# EAGLE design clock (EAGLE 7.1.0)
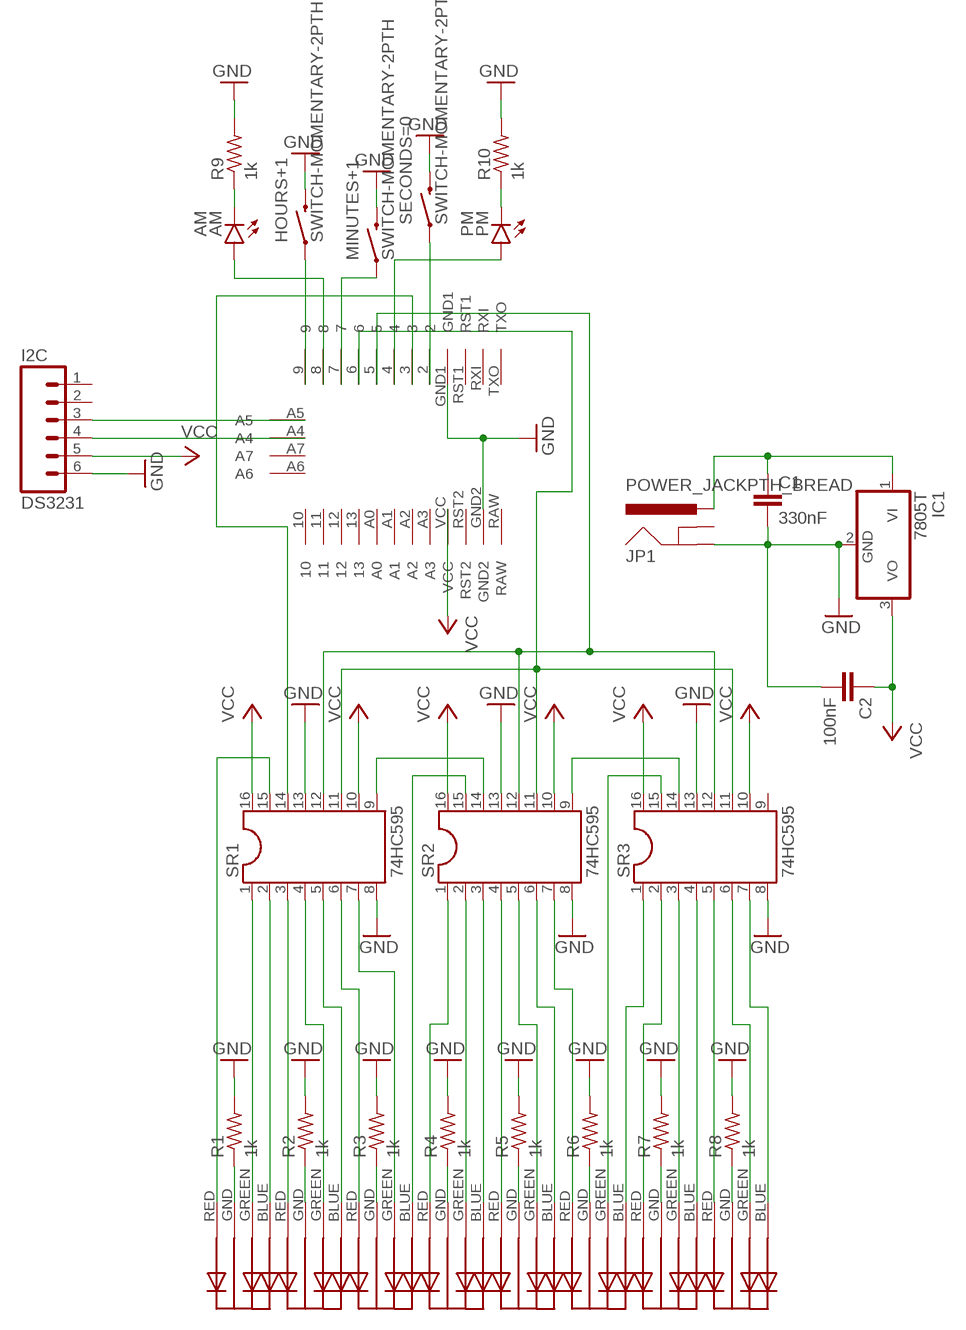
[diagram p0: schematic, sheet 1]

## Parts
AM  AM  LED5MM  [LED5MM]
C1  330nF  CAPPTH1  [CAP-PTH-5MM]
C2  100nF  CAPPTH1  [CAP-PTH-5MM]
DS3231  I2C  M06LOCK  [1X06_LOCK]
HOURS+1  SWITCH-MOMENTARY-2PTH  [TACTILE-PTH]
IC1  7805T  7805TV  [TO220V]
JP1  POWER_JACKPTH_BREAD  [POWER_JACK_PTH_BREAD]
MINUTES+1  SWITCH-MOMENTARY-2PTH  [TACTILE-PTH]
PM  PM  LED5MM  [LED5MM]
R1  1k  R-US_0207/10  [0207/10]
R2  1k  R-US_0207/10  [0207/10]
R3  1k  R-US_0207/10  [0207/10]
R4  1k  R-US_0207/10  [0207/10]
R5  1k  R-US_0207/10  [0207/10]
R6  1k  R-US_0207/10  [0207/10]
R7  1k  R-US_0207/10  [0207/10]
R8  1k  R-US_0207/10  [0207/10]
R9  1k  R-US_0207/10  [0207/10]
R10  1k  R-US_0207/10  [0207/10]
SECONDS=0  SWITCH-MOMENTARY-2PTH  [TACTILE-PTH]
SR1  74HC595  DIL16S  [SOCKET-16]
SR2  74HC595  DIL16S  [SOCKET-16]
SR3  74HC595  DIL16S  [SOCKET-16]
U$1  PRO-MINI  [PRO-MINI]
U$2  RGB_LED_COM_CATH  [RGB_LED_COM_CATH]
U$3  RGB_LED_COM_CATH  [RGB_LED_COM_CATH]
U$4  RGB_LED_COM_CATH  [RGB_LED_COM_CATH]
U$5  RGB_LED_COM_CATH  [RGB_LED_COM_CATH]
U$6  RGB_LED_COM_CATH  [RGB_LED_COM_CATH]
U$7  RGB_LED_COM_CATH  [RGB_LED_COM_CATH]
U$8  RGB_LED_COM_CATH  [RGB_LED_COM_CATH]
U$9  RGB_LED_COM_CATH  [RGB_LED_COM_CATH]

## Nets
GND: C1.2 C2.2 DS3231.6 HOURS+1.3 IC1.2(GND) JP1.GND MINUTES+1.3 R1.2 R2.2 R3.2 R4.2 R5.2 R6.2 R7.2 R8.2 R9.2 R10.2 SECONDS=0.3 SR1.8 SR1.13 SR2.8 SR2.13 SR3.8 SR3.13 U$1.GND1 U$1.GND2
N$1: SR1.6 U$2.RED
N$2: SR1.9 SR2.14
N$3: SR2.9 SR3.14
N$4: SR1.11 SR2.11 SR3.11 U$1.6
N$5: SR1.12 SR2.12 SR3.12 U$1.5
N$6: SR1.14 U$1.3
N$7: SR1.15 U$4.RED
N$8: SR1.1 U$4.GREEN
N$9: SR1.2 U$4.BLUE
N$10: R1.1 U$4.GND
N$11: SR1.3 U$3.RED
N$12: SR1.4 U$3.GREEN
N$13: SR1.5 U$3.BLUE
N$14: R2.1 U$3.GND
N$15: SR1.7 U$2.GREEN
N$16: SR2.15 U$2.BLUE
N$17: R3.1 U$2.GND
N$18: R4.1 U$5.GND
N$19: SR2.1 U$5.RED
N$20: SR2.2 U$5.GREEN
N$21: SR2.3 U$5.BLUE
N$22: SR2.4 U$6.RED
N$23: SR2.5 U$6.GREEN
N$24: SR2.6 U$6.BLUE
N$25: R5.1 U$6.GND
N$26: SR2.7 U$7.RED
N$27: R6.1 U$7.GND
N$28: SR3.3 U$8.GREEN
N$29: SR3.1 U$7.BLUE
N$30: SR3.15 U$7.GREEN
N$31: R7.1 U$8.GND
N$32: SR3.2 U$8.RED
N$33: SR3.4 U$8.BLUE
N$34: SR3.5 U$9.RED
N$35: R8.1 U$9.GND
N$36: SR3.6 U$9.GREEN
N$37: SR3.7 U$9.BLUE
N$38: DS3231.3 U$1.A5
N$39: DS3231.4 U$1.A4
N$40: HOURS+1.1 U$1.9
N$41: AM.A U$1.8
N$42: MINUTES+1.1 U$1.7
N$43: PM.A U$1.4
N$44: SECONDS=0.1 U$1.2
N$45: AM.K(C) R9.1
N$46: PM.K(C) R10.1
N$48: C1.1 IC1.1(VI) JP1.PWR
VCC: C2.1 DS3231.5 IC1.3(VO) SR1.10 SR1.16 SR2.10 SR2.16 SR3.10 SR3.16 U$1.VCC
Unconnected: DS3231.1 DS3231.2 JP1.GNDBREAK SR3.9 U$1.10 U$1.11 U$1.12 U$1.13 U$1.A0 U$1.A1 U$1.A2 U$1.A3 U$1.A6 U$1.A7 U$1.RAW U$1.RST1 U$1.RST2 U$1.RXI U$1.TXO

## Library data of the parts
AM PM = SparkFun-LED:LED: LEDs Standard schematic elements and footprints for 5mm, 3mm, 1206, and 0603 sized LEDs. 5mm - Spark Fun Electronics SKU : COM-00529 (and others)
C1 C2 = SparkFun-Capacitors:CAP: Capacitor Standard 0603 ceramic capacitor, and 0.1" leaded capacitor.
DS3231 = SparkFun-Connectors:M06: Header 6 Standard 6-pin 0.1" header. Use with straight break away headers (SKU : PRT-00116), right angle break away headers (PRT-00553), swiss pins (PRT-00743), machine pins (PRT-00117), and female headers (PRT-00115). Molex polarized connector foot print use with SKU : PRT-08094 with associated crimp pins and housings. NOTES ON THE VARIANTS LOCK and LOCK_LONGPADS... This footprint was designed to help hold the alignment of a through-hole component (i.e. 6-pin header) while soldering it into place. You may notice that each hole has been shifted either up or down by 0.005 of an inch from it's more standard position (which is a perfectly straight line). This slight alteration caused the pins (the squares in the middle) to touch the edges of the holes. Because they are alternating, it causes a "brace" to hold the component in place. 0.005 has proven to be the perfect amount of "off-center" position when using our standard breakaway headers. Although looks a little odd when you look at the bare footprint, once you have a header in there, the alteration is very hard to notice. Also,if you push a header all the way into place, it is covered up entirely on the bottom side. This idea of altering the position of holes to aid alignment will be further integrated into the Sparkfun Library for other footprints. It can help hold any component with 3 or more connection pins.
HOURS+1 MINUTES+1 SECONDS=0 = SparkFun-Electromechanical:SWITCH-MOMENTARY-2: Various NO switches- pushbuttons, reed, etc
IC1 = linear:78*: Positive VOLTAGE REGULATOR Source: http://cache.national.com/ds/LM/LM78L05.pdf http://www.fairchildsemi.com/ds/LM/LM7805.pdf
JP1 = SparkFun-Connectors:POWER_JACK: Power Jack This is the standard 5.5mm barrel jack for power. The PTH is the most common, proven, reliable, footprint. The Slot footprint only works if the mill layer is transmitted to the PCB fab house so be warned. Mating wall wart : TOL-00298 (and others); PROD_ID: PRT-10811
R1-R10 = resistor:R-US_: RESISTOR, American symbol
SR1-SR3 = ic-package:DIL16: Dual In Line / Socket
U$1 = dbyrne:PRO-MINI: Arduion Pro Mini Clone V1.0 www.betemcu.cu
U$2-U$9 = dbyrne:RGB_LED_COM_CATH

## Net classes
0 default: width 0.305 mm, drill 0.508 mm, clearance 0.254 mm

## Board
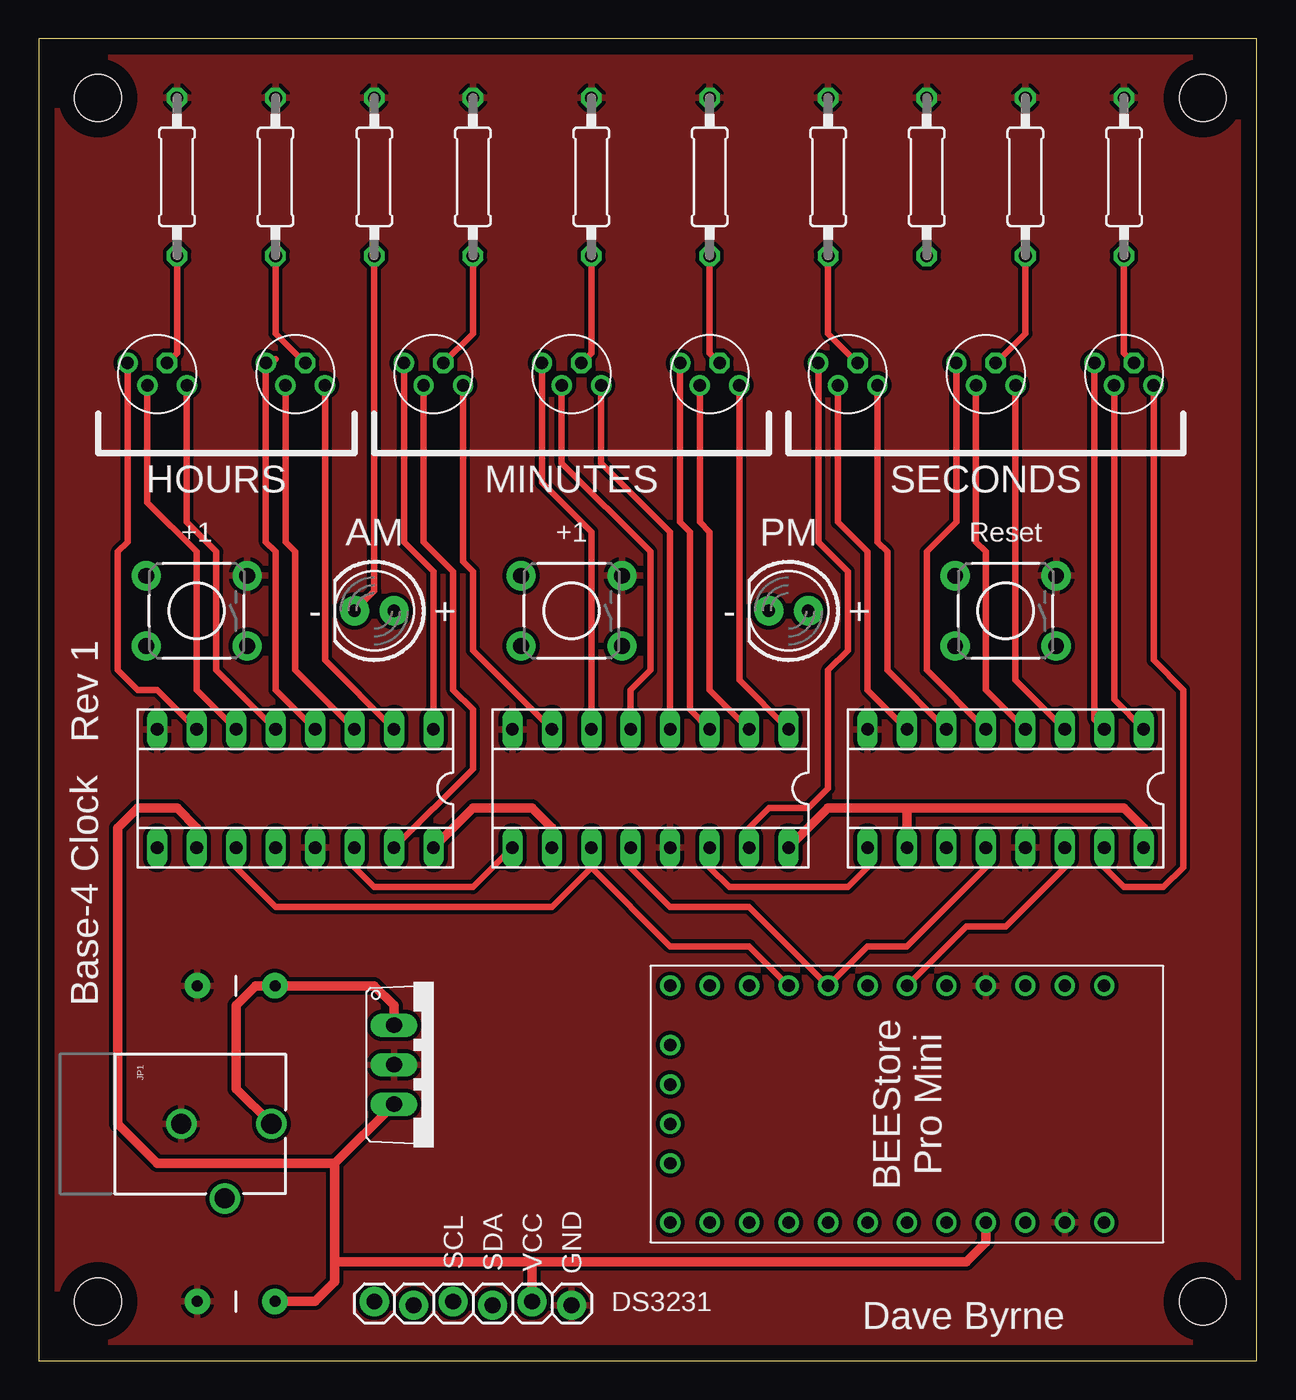
[diagram p1: board, top side]
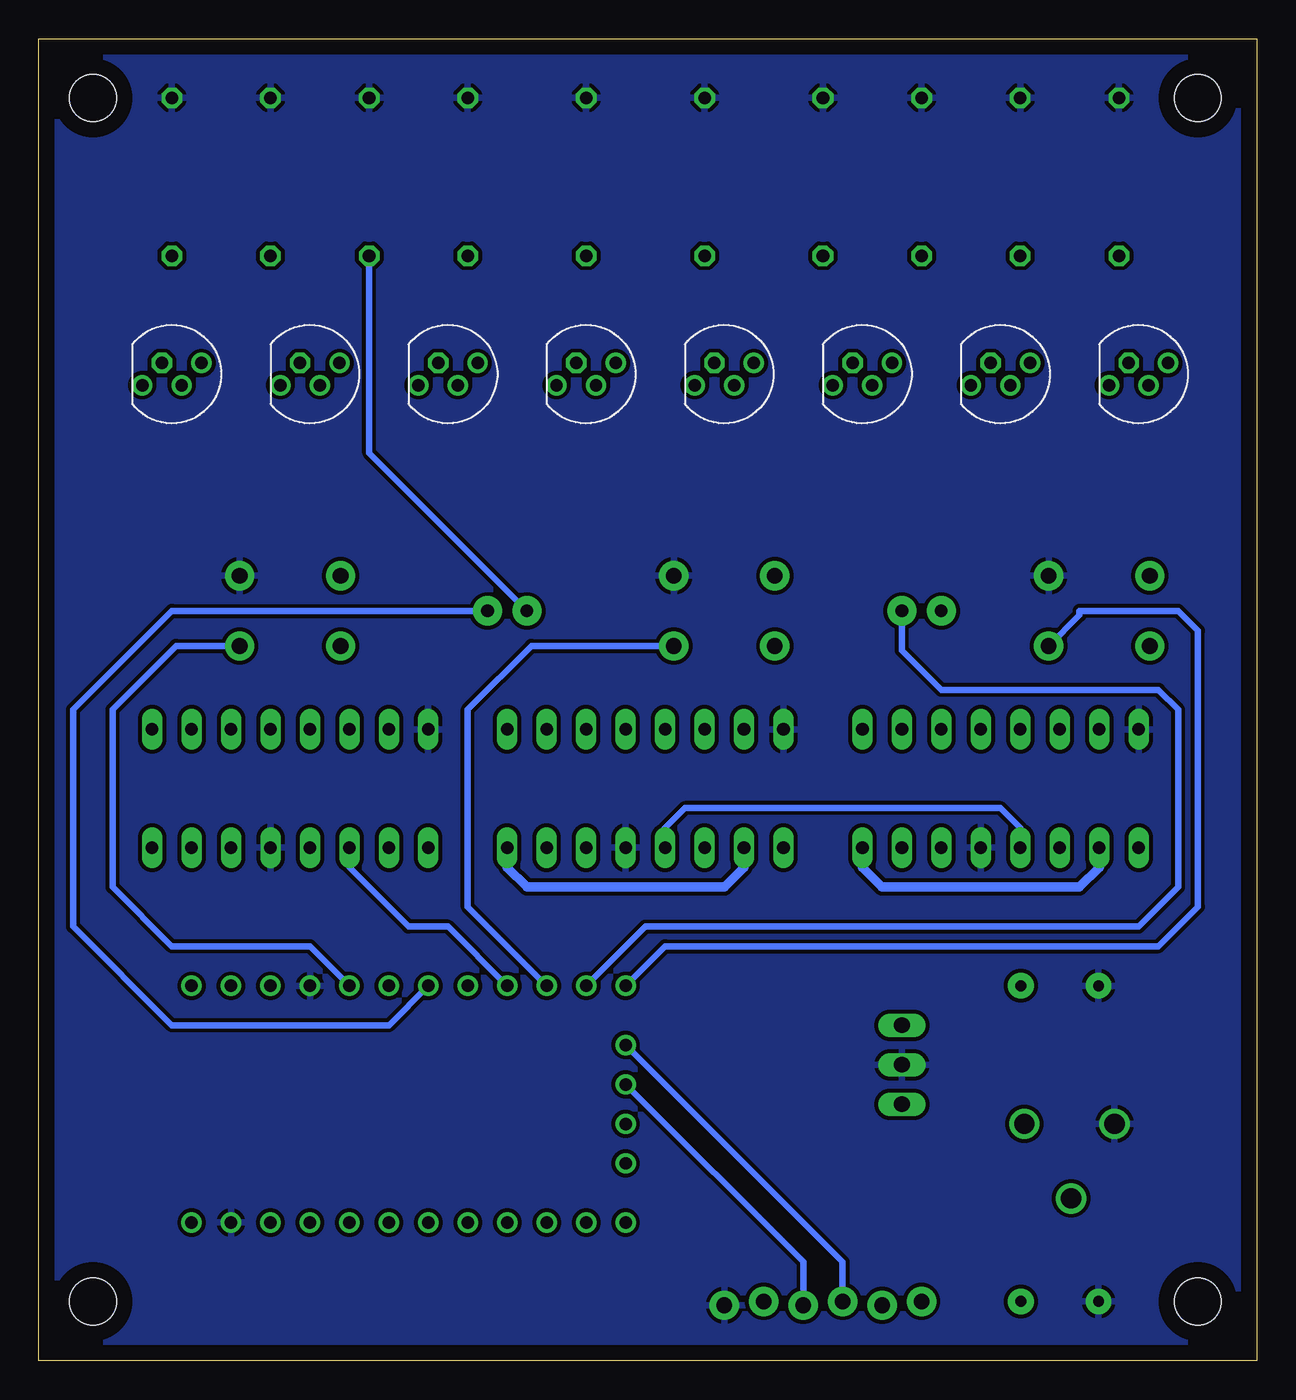
[diagram p2: board, bottom side, seen from below]

Size 78.41 x 85.08 mm. Coordinates in mm from the lower left corner, seen from the top.
Outline: 0,0 78.41,0 78.41,85.08 0,85.08 0,0
Copper layers (1*16): Top 0.035mm / dielectric 1.5mm / Bottom 0.035mm
Design rules "default *": minimum track width 10mil, minimum drill 20mil, track to track 8mil, track to pad 8mil, pad to pad 8mil, via to via 8mil, smd to smd 8mil, copper to edge 40mil, drill to drill 8mil, minimum pad ring 10mil, minimum via ring 8mil, stop-mask expansion 4mil, vias tented up to drill 0mil, thermal gap 10mil
Holes 3 mm at 3.81,81.28 74.93,81.28 3.81,3.81 74.93,3.81

### Footprints (pad centres in the part's own frame; a part is rotated, then mirrored left to right if it is on the bottom)
LED5MM = drill 0.813 pad 1.88: A -1.27,0; K 1.27,0
CAP-PTH-5MM = drill 0.7 pad 1.651: 1 -2.5,0; 2 2.5,0
1X06_LOCK = drill 1.016 pad 1.88: 1 0,0; 2 2.54,-0.254; 3 5.08,0; 4 7.62,-0.254; 5 10.16,0; 6 12.7,-0.254
TACTILE-PTH = drill 1.016 pad 1.88: 1 -3.251,2.261; 2 3.251,2.261; 3 -3.251,-2.261; 4 3.251,-2.261
TO220V = drill 1.016 long: 1 -2.54,-2.54; 2 0,-2.54; 3 2.54,-2.54
POWER_JACK_PTH_BREAD = drill 1.3: GND 0,7.9; GNDBREAK 4.8,10.7; PWR 0,13.7
0207/10 = drill 0.813 octagon: 1 -5.08,0; 2 5.08,0
SOCKET-16 = drill 0.813 long: 1 -8.89,-3.81; 2 -6.35,-3.81; 3 -3.81,-3.81; 4 -1.27,-3.81; 5 1.27,-3.81; 6 3.81,-3.81; 7 6.35,-3.81; 8 8.89,-3.81; 9 8.89,3.81; 10 6.35,3.81; 11 3.81,3.81; 12 1.27,3.81; 13 -1.27,3.81; 14 -3.81,3.81; 15 -6.35,3.81; 16 -8.89,3.81
PRO-MINI = drill 0.8: 2 -6.35,16.51; 3 -6.35,13.97; 4 -6.35,11.43; 5 -6.35,8.89; 6 -6.35,6.35; 7 -6.35,3.81; 8 -6.35,1.27; 9 -6.35,-1.27; 10 8.89,-1.27; 11 8.89,1.27; 12 8.89,3.81; 13 8.89,6.35; A0 8.89,8.89; A1 8.89,11.43; A2 8.89,13.97; A3 8.89,16.51; A4 0,-1.27; A5 -2.54,-1.27; A6 5.08,-1.27; A7 2.54,-1.27; GND1 -6.35,19.05; GND2 8.89,24.13; RAW 8.89,26.67; RST1 -6.35,21.59; RST2 8.89,21.59; RXI -6.35,24.13; TXO -6.35,26.67; VCC 8.89,19.05
RGB_LED_COM_CATH = drill 0.8 pad 0.813: BLUE -1.905,0.714; GREEN -0.635,-0.714; RED 1.905,-0.714 | drill 0.8 pad 0.813 octagon: GND 0.635,0.714

### Placement (x,y rotation side)
AM  21.59,48.26 180 top
C1  12.7,24.13 180 top
C2  12.7,3.81 180 top
DS3231  21.59,3.81 0 top
HOURS+1  10.16,48.26 180 top
IC1  25.4,19.05 270 top
JP1  1.27,15.24 270 top
MINUTES+1  34.29,48.26 180 top
PM  48.26,48.26 180 top
R1  69.85,76.2 90 top
R2  63.5,76.2 90 top
R3  50.8,76.2 90 top
R4  43.18,76.2 90 top
R5  35.56,76.2 90 top
R6  27.94,76.2 90 top
R7  15.24,76.2 90 top
R8  8.89,76.2 90 top
R9  21.59,76.2 90 top
R10  57.15,76.2 90 top
SECONDS=0  62.23,48.26 180 top
SR1  62.23,36.83 180 top
SR2  39.37,36.83 180 top
SR3  16.51,36.83 180 top
U$1  41.91,17.78 270 top
U$2  52.07,63.5 0 top
U$3  60.96,63.5 0 top
U$4  69.85,63.5 0 top
U$5  43.18,63.5 0 top
U$6  34.29,63.5 0 top
U$7  25.4,63.5 0 top
U$8  16.51,63.5 0 top
U$9  7.62,63.5 0 top

### Tracks (layer width: path | path; a pad name or v marks a point on that pad's centre or on a via)
GND
  pour Bottom: -2.54,87.63 -2.54,-2.54 80.01,-2.54 80.01,87.63
  pour Top: -2.54,87.63 -2.54,-3.81 81.28,-3.81 81.28,87.63
N$1
  Top 0.406: SR1.6 54.61,44.45 54.61,52.07 53.98,52.7 U$2.RED
N$2
  Top 0.406: SR2.14 43.18,31.75 44.45,30.48 52.07,30.48 53.34,31.75 SR1.9
N$3
  Top 0.406: SR2.9 27.94,30.48 21.59,30.48 20.32,31.75 SR3.14
N$4
  Top 0.406: U$1.6 45.72,26.67 40.64,26.67 35.56,31.75 | 35.56,31.75 SR2.11 | SR3.11 12.7,31.75 15.24,29.21 33.02,29.21 35.56,31.75
  Bottom 0.406: U$1.6 52.07,27.94 54.61,27.94 58.42,31.75 SR1.11
N$5
  Top 0.406: SR1.12 60.96,31.75 55.88,26.67 53.34,26.67 U$1.5 45.72,29.21 40.64,29.21 38.1,31.75 SR2.12
  Bottom 0.406: SR3.12 15.24,34.29 16.51,35.56 36.83,35.56 38.1,34.29 SR2.12
N$6
  Top 0.406: U$1.3 59.69,27.94 62.23,27.94 66.04,31.75 SR1.14
N$7
  Top 0.406: SR1.15 68.58,31.75 69.85,30.48 72.39,30.48 73.66,31.75 73.66,43.18 71.75,45.09 U$4.RED
N$8
  Top 0.406: SR1.1 69.22,42.55 U$4.GREEN
N$9
  Top 0.406: SR1.2 67.94,41.27 U$4.BLUE
N$10
  Top 0.406: U$4.GND 69.85,64.85 R1.1
N$11
  Top 0.406: SR1.3 62.87,43.81 U$3.RED
N$12
  Top 0.406: SR1.4 60.96,43.18 60.96,52.07 60.33,52.7 U$3.GREEN
N$13
  Top 0.406: SR1.5 57.15,44.45 57.15,52.07 59.05,53.98 U$3.BLUE
N$14
  Top 0.406: U$3.GND 63.5,66.12 R2.1
N$15
  Top 0.406: SR1.7 53.34,43.18 53.34,52.07 51.44,53.98 U$2.GREEN
N$16
  Top 0.406: SR2.15 45.72,34.29 46.99,35.56 49.53,35.56 50.8,36.83 50.8,44.45 52.07,45.72 52.07,50.8 50.16,52.7 U$2.BLUE
N$17
  Top 0.406: U$2.GND 50.8,66.12 R3.1
N$18
  Top 0.406: U$5.GND 43.18,64.85 R4.1
N$19
  Top 0.406: SR2.1 45.09,43.81 U$5.RED
N$20
  Top 0.406: SR2.2 43.18,43.18 43.18,53.34 42.55,53.98 U$5.GREEN
N$21
  Top 0.406: SR2.3 41.91,41.91 41.91,53.34 41.27,53.98 U$5.BLUE
N$22
  Top 0.406: SR2.4 40.64,53.34 36.2,57.78 U$6.RED
N$23
  Top 0.406: SR2.5 38.1,43.18 39.37,44.45 39.37,52.07 33.66,57.78 U$6.GREEN
N$24
  Top 0.406: SR2.6 35.56,53.34 32.38,56.52 U$6.BLUE
N$25
  Top 0.406: U$6.GND 35.56,64.85 R5.1
N$26
  Top 0.406: SR2.7 27.94,45.72 27.94,50.8 27.3,51.44 U$7.RED
N$27
  Top 0.406: U$7.GND 27.94,66.12 R6.1
N$28
  Top 0.406: SR3.3 16.51,44.45 16.51,52.07 15.88,52.7 U$8.GREEN
N$29
  Top 0.406: SR3.1 25.4,50.8 23.5,52.7 U$7.BLUE
N$30
  Top 0.406: SR3.15 27.94,38.1 27.94,41.91 26.67,43.18 26.67,50.8 24.77,52.7 U$7.GREEN
N$31
  Top 0.406: U$8.GND 15.24,66.12 R7.1
N$32
  Top 0.406: SR3.2 18.41,45.09 U$8.RED
N$33
  Top 0.406: 15.24,64.48 U$8.BLUE 14.61,52.7 15.24,52.07 15.24,43.18 SR3.4
N$34
  Top 0.406: SR3.5 11.43,44.45 11.43,52.07 9.53,53.98 U$9.RED
N$35
  Top 0.406: U$9.GND 8.89,64.85 R8.1
N$36
  Top 0.406: SR3.6 10.16,43.18 10.16,52.07 6.99,55.24 U$9.GREEN
N$37
  Top 0.406: SR3.7 7.62,43.18 6.35,43.18 5.08,44.45 5.08,52.07 5.71,52.7 U$9.BLUE
N$38
  Bottom 0.406: U$1.A5 26.67,6.35 DS3231.3
N$39
  Bottom 0.406: U$1.A4 29.21,6.35 DS3231.4
N$40
  Bottom 0.406: U$1.9 38.1,26.67 6.35,26.67 3.81,29.21 3.81,46.99 5.08,48.26 11.43,48.26 11.43,47.98 HOURS+1.1
N$41
  Bottom 0.406: U$1.8 39.37,27.94 7.62,27.94 5.08,30.48 5.08,41.91 6.35,43.18 20.32,43.18 22.86,45.72 AM.A
N$42
  Bottom 0.406: U$1.7 50.8,29.21 50.8,41.91 46.71,46 MINUTES+1.1
N$43
  Bottom 0.406: U$1.4 55.88,21.59 69.85,21.59 76.2,27.94 76.2,41.91 69.85,48.26 PM.A
N$44
  Bottom 0.406: U$1.2 60.96,26.67 69.85,26.67 73.66,30.48 73.66,41.91 69.57,46 SECONDS=0.1
N$45
  Top 0.406: AM.K 21.59,49.53 R9.1
N$46
  Bottom 0.406: PM.K 57.15,58.42 R10.1
N$48
  Top 0.61: JP1.PWR 12.7,17.51 12.7,22.86 13.97,24.13 C1.1 21.59,24.13 22.86,22.86 IC1.1
VCC
  Top 0.61: IC1.3 19.05,12.7 | 19.05,12.7 7.62,12.7 5.08,15.24 5.08,34.29 6.35,35.56 8.89,35.56 10.16,34.29 SR3.10 | SR3.16 27.94,35.56 31.75,35.56 33.02,34.29 SR2.10 | SR2.16 50.8,35.56 55.88,35.56 | SR1.10 55.88,35.56 | 55.88,35.56 69.85,35.56 71.12,34.29 SR1.16 | 19.05,12.7 19.05,6.35 | C2.1 17.78,3.81 19.05,5.08 19.05,6.35 | 19.05,6.35 30.48,6.35 31.75,6.35 | 31.75,6.35 DS3231.5 | U$1.VCC 60.96,7.62 59.69,6.35 31.75,6.35
  Bottom 0.61: SR3.10 10.16,31.75 11.43,30.48 24.13,30.48 25.4,31.75 SR3.16 | SR2.10 33.02,31.75 34.29,30.48 46.99,30.48 48.26,31.75 SR2.16

### Text on the board
tNames: HOURS | MINUTES | SECONDS | +1 | AM | +1 | PM | Reset | - | + | - | + | Base-4 Clock Rev 1 | SCL | SDA | VCC | GND | DS3231 | Dave Byrne